# Altium schematic sheet 2_topology.schdoc: OBDH Topology
size A3; Engineer: Eng_2_ALT; SheetNumber: 2; SheetTotal: 6; Designed by: André M. P. Mattos; Version: v0.7; ProjectRevision: v0.7; ProjectCode: obdh2
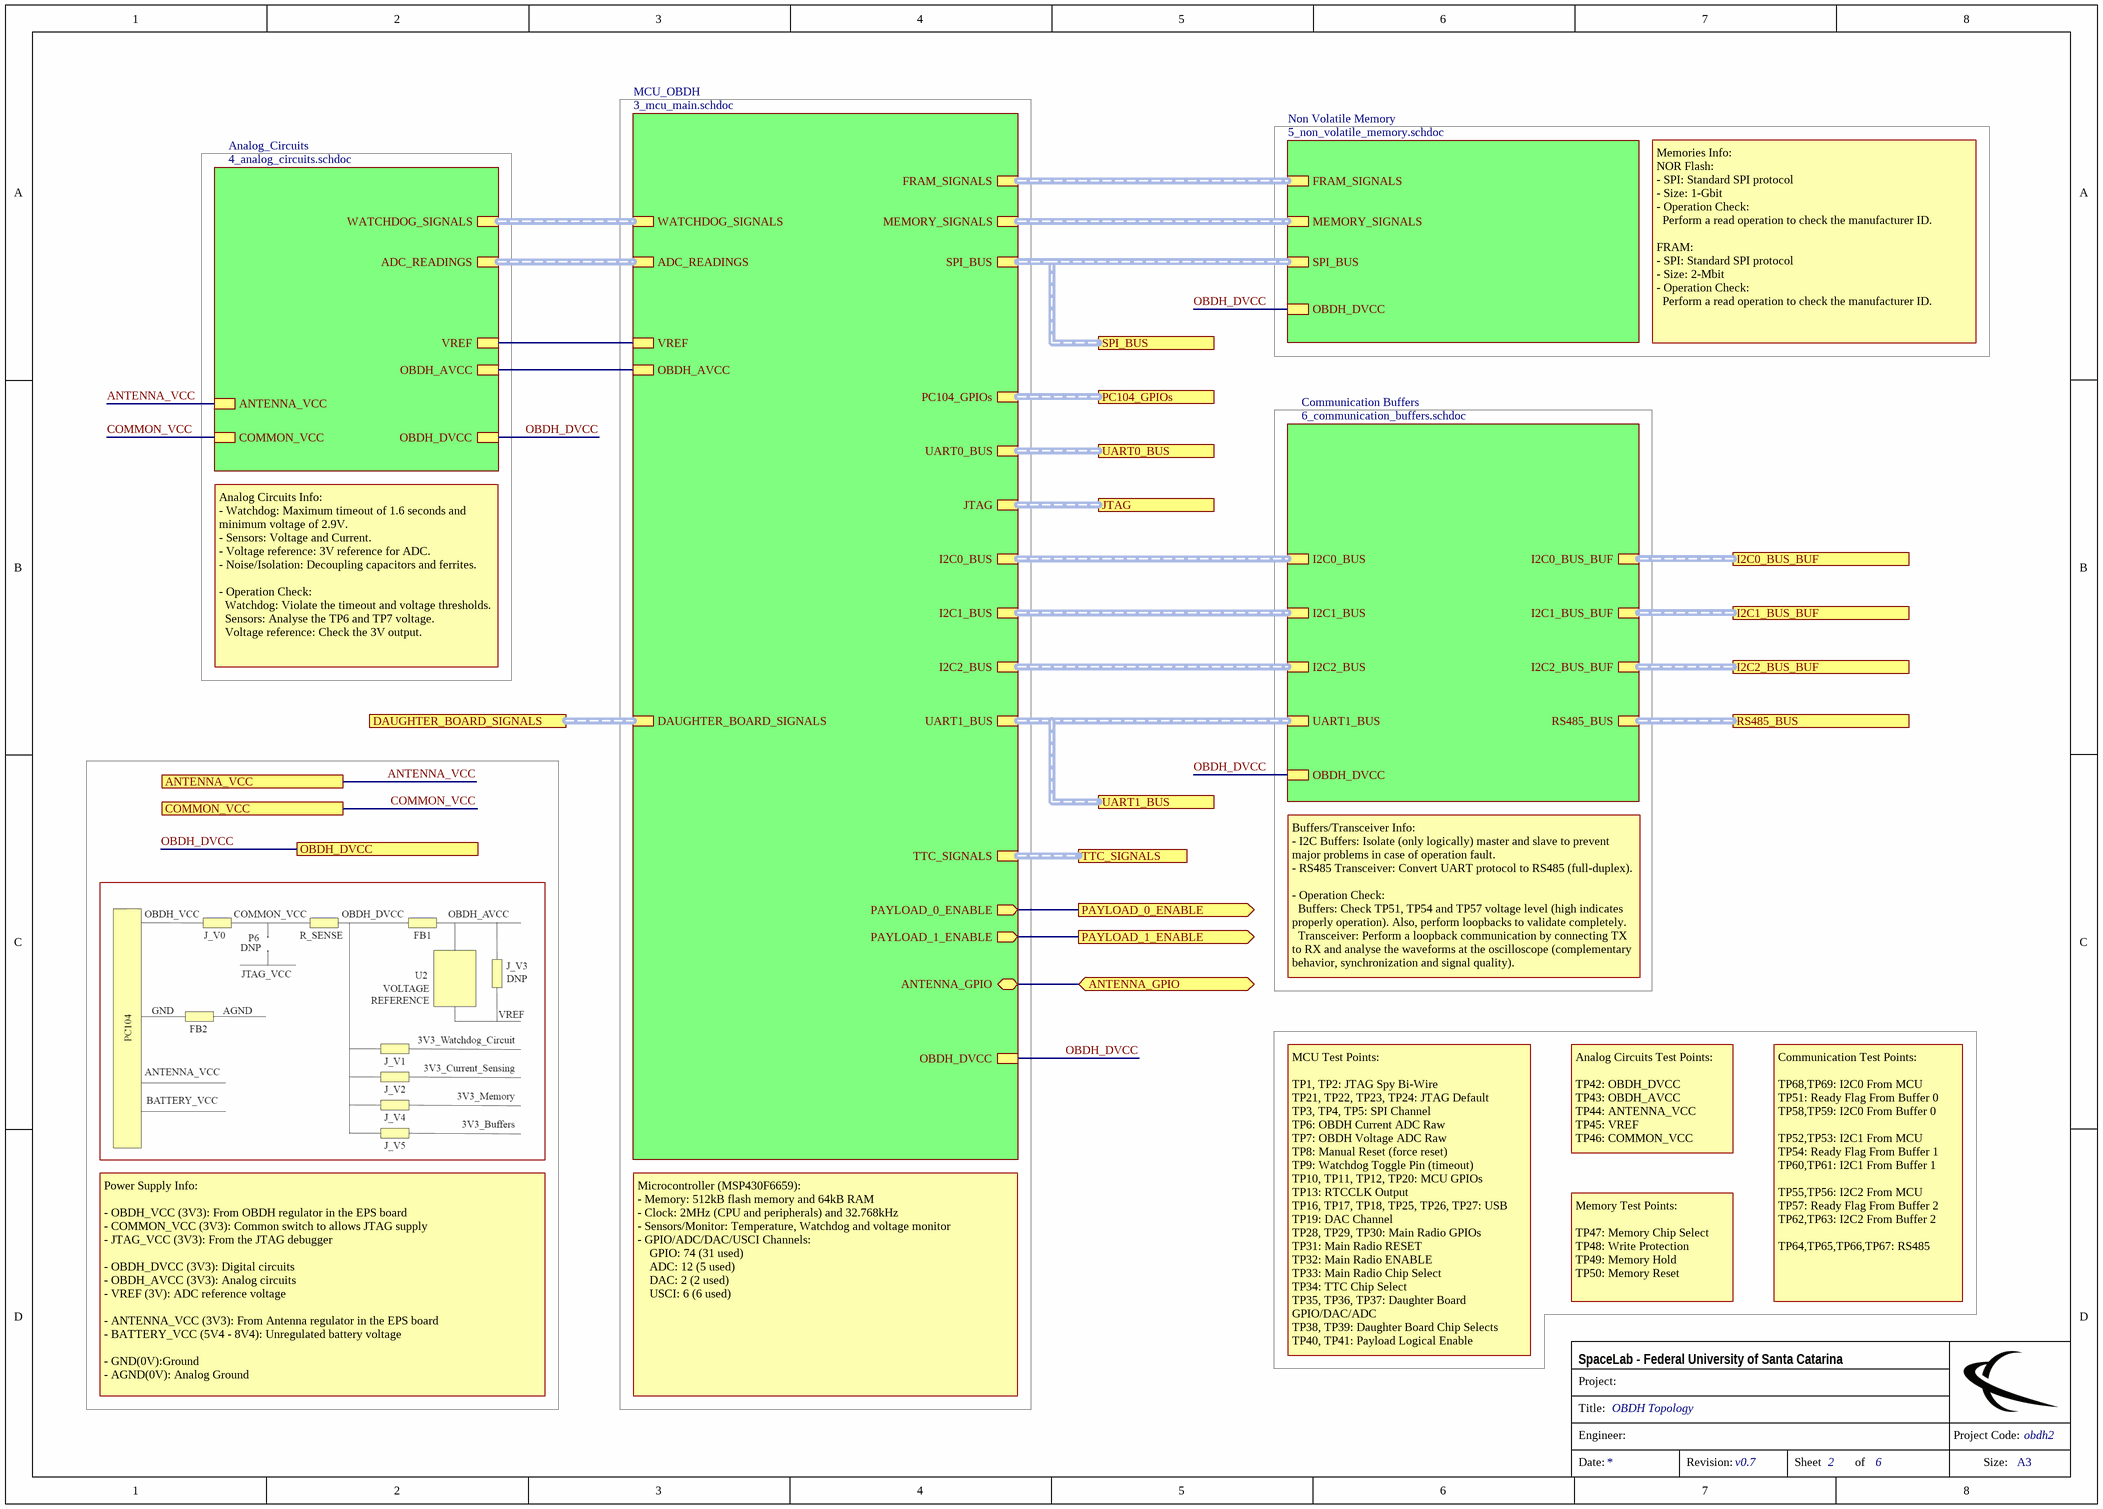
[diagram p0: 2_topology.schdoc]

## Sub-sheets
Analog_Circuits = 4_analog_circuits.schdoc: COMMON_VCC, ADC_READINGS (harness ADC_READINGS), OBDH_DVCC, ANTENNA_VCC, OBDH_AVCC, VREF, WATCHDOG_SIGNALS (harness WATCHDOG_SIGNALS)
Communication Buffers = 6_communication_buffers.schdoc: OBDH_DVCC, I2C0_BUS (harness I2C0_BUS), I2C1_BUS (harness I2C1_BUS), I2C2_BUS (harness I2C2_BUS), UART1_BUS (harness UART1_BUS), RS485_BUS (harness RS485_BUS), I2C0_BUS_BUF (harness I2C0_BUS_BUF), I2C1_BUS_BUF (harness I2C1_BUS_BUF), I2C2_BUS_BUF (harness I2C2_BUS_BUF)
MCU_OBDH = 3_mcu_main.schdoc: JTAG (harness JTAG), UART0_BUS (harness UART0_BUS), PAYLOAD_0_ENABLE (out), ADC_READINGS (harness ADC_READINGS), PAYLOAD_1_ENABLE (out), I2C2_BUS (harness I2C2_BUS), I2C0_BUS (harness I2C0_BUS), ANTENNA_GPIO (bidir), UART1_BUS (harness UART1_BUS), I2C1_BUS (harness I2C1_BUS), SPI_BUS (harness SPI_BUS), TTC_SIGNALS (harness TTC_SIGNALS), OBDH_AVCC, VREF, WATCHDOG_SIGNALS (harness WATCHDOG_SIGNALS), OBDH_DVCC, DAUGHTER_BOARD_SIGNALS (harness DAUGHTER_BOARD_SIGNALS), PC104_GPIOs (harness PC104_GPIOs), MEMORY_SIGNALS (harness MEMORY_SIGNALS), FRAM_SIGNALS (harness FRAM_SIGNALS)
Non Volatile Memory = 5_non_volatile_memory.schdoc: OBDH_DVCC, SPI_BUS (harness SPI_BUS), MEMORY_SIGNALS (harness MEMORY_SIGNALS), FRAM_SIGNALS (harness FRAM_SIGNALS)

## Ports
ANTENNA_GPIO (bidir), ANTENNA_VCC, COMMON_VCC, DAUGHTER_BOARD_SIGNALS (harness DAUGHTER_BOARD_SIGNALS), I2C0_BUS_BUF (harness I2C0_BUS), I2C1_BUS_BUF (harness I2C0_BUS), I2C2_BUS_BUF (harness I2C2_BUS), JTAG (harness TTC_SIGNALS), OBDH_DVCC, PAYLOAD_0_ENABLE (out), PAYLOAD_1_ENABLE (out), PC104_GPIOs (harness TTC_SIGNALS), RS485_BUS (harness I2C2_BUS), SPI_BUS (harness I2C0_BUS), TTC_SIGNALS (harness TTC_SIGNALS), UART0_BUS (harness TTC_SIGNALS), UART1_BUS (harness I2C0_BUS)

## Nets
ANTENNA_GPIO: port ANTENNA_GPIO, sheet MCU_OBDH/ANTENNA_GPIO
ANTENNA_VCC: port ANTENNA_VCC, sheet Analog_Circuits/ANTENNA_VCC
COMMON_VCC: port COMMON_VCC, sheet Analog_Circuits/COMMON_VCC
OBDH_DVCC: port OBDH_DVCC, sheet MCU_OBDH/OBDH_DVCC, sheet Analog_Circuits/OBDH_DVCC, sheet Non Volatile Memory/OBDH_DVCC, sheet Communication Buffers/OBDH_DVCC
PAYLOAD_0_ENABLE: port PAYLOAD_0_ENABLE, sheet MCU_OBDH/PAYLOAD_0_ENABLE
PAYLOAD_1_ENABLE: port PAYLOAD_1_ENABLE, sheet MCU_OBDH/PAYLOAD_1_ENABLE
(unnamed): sheet MCU_OBDH/OBDH_AVCC, sheet Analog_Circuits/OBDH_AVCC
(unnamed): sheet MCU_OBDH/VREF, sheet Analog_Circuits/VREF

## Buses and harness runs
harness port DAUGHTER_BOARD_SIGNALS = sheet MCU_OBDH/DAUGHTER_BOARD_SIGNALS
harness port I2C0_BUS_BUF = sheet Communication Buffers/I2C0_BUS_BUF
harness port I2C1_BUS_BUF = sheet Communication Buffers/I2C1_BUS_BUF
harness port I2C2_BUS_BUF = sheet Communication Buffers/I2C2_BUS_BUF
harness port JTAG = sheet MCU_OBDH/JTAG
harness port PC104_GPIOs = sheet MCU_OBDH/PC104_GPIOs
harness port RS485_BUS = sheet Communication Buffers/RS485_BUS
harness port SPI_BUS = sheet MCU_OBDH/SPI_BUS = sheet Non Volatile Memory/SPI_BUS
harness port TTC_SIGNALS = sheet MCU_OBDH/TTC_SIGNALS
harness port UART0_BUS = sheet MCU_OBDH/UART0_BUS
harness port UART1_BUS = sheet Communication Buffers/UART1_BUS = sheet MCU_OBDH/UART1_BUS
harness sheet Analog_Circuits/ADC_READINGS = sheet MCU_OBDH/ADC_READINGS
harness sheet Analog_Circuits/WATCHDOG_SIGNALS = sheet MCU_OBDH/WATCHDOG_SIGNALS
harness sheet Communication Buffers/I2C0_BUS = sheet MCU_OBDH/I2C0_BUS
harness sheet Communication Buffers/I2C1_BUS = sheet MCU_OBDH/I2C1_BUS
harness sheet Communication Buffers/I2C2_BUS = sheet MCU_OBDH/I2C2_BUS
harness sheet MCU_OBDH/FRAM_SIGNALS = sheet Non Volatile Memory/FRAM_SIGNALS
harness sheet MCU_OBDH/MEMORY_SIGNALS = sheet Non Volatile Memory/MEMORY_SIGNALS

## Notes on the sheet
- Memories Info:
  NOR Flash:
  - SPI: Standard SPI protocol
  - Size: 1-Gbit
  - Operation Check:
  Perform a read operation to check the manufacturer ID.
  FRAM:
  - SPI: Standard SPI protocol
  - Size: 2-Mbit
  - Operation Check:
  Perform a read operation to check the manufacturer ID.
- Analog Circuits Info:
  - Watchdog: Maximum timeout of 1.6 seconds and minimum voltage of 2.9V.
  - Sensors: Voltage and Current.
  - Voltage reference: 3V reference for ADC.
  - Noise/Isolation: Decoupling capacitors and ferrites.
  - Operation Check:
  Watchdog: Violate the timeout and voltage thresholds.
  Sensors: Analyse the TP6 and TP7 voltage.
  Voltage reference: Check the 3V output.
- Buffers/Transceiver Info:
  - I2C Buffers: Isolate (only logically) master and slave to prevent major problems in case of operation fault.
  - RS485 Transceiver: Convert UART protocol to RS485 (full-duplex).
  - Operation Check:
  Buffers: Check TP51, TP54 and TP57 voltage level (high indicates properly operation). Also, perform loopbacks to validate completely.
  Transceiver: Perform a loopback communication by connecting TX to RX and analyse the waveforms at the oscilloscope (complementary behavior, synchronization and signal quality).
- Analog Circuits Test Points:
  TP42: OBDH_DVCC
  TP43: OBDH_AVCC
  TP44: ANTENNA_VCC
  TP45: VREF
  TP46: COMMON_VCC
- Memory Test Points:
  TP47: Memory Chip Select
  TP48: Write Protection
  TP49: Memory Hold
  TP50: Memory Reset
- Communication Test Points:
  TP68,TP69: I2C0 From MCU
  TP51: Ready Flag From Buffer 0
  TP58,TP59: I2C0 From Buffer 0
  TP52,TP53: I2C1 From MCU
  TP54: Ready Flag From Buffer 1
  TP60,TP61: I2C1 From Buffer 1
  TP55,TP56: I2C2 From MCU
  TP57: Ready Flag From Buffer 2
  TP62,TP63: I2C2 From Buffer 2
  TP64,TP65,TP66,TP67: RS485
- Power Supply Info:
  - OBDH_VCC (3V3): From OBDH regulator in the EPS board
  - COMMON_VCC (3V3): Common switch to allows JTAG supply
  - JTAG_VCC (3V3): From the JTAG debugger
  - OBDH_DVCC (3V3): Digital circuits
  - OBDH_AVCC (3V3): Analog circuits
  - VREF (3V): ADC reference voltage
  - ANTENNA_VCC (3V3): From Antenna regulator in the EPS board
  - BATTERY_VCC (5V4 - 8V4): Unregulated battery voltage
  - GND(0V):Ground
  - AGND(0V): Analog Ground
- Microcontroller (MSP430F6659):
  - Memory: 512kB flash memory and 64kB RAM
  - Clock: 2MHz (CPU and peripherals) and 32.768kHz
  - Sensors/Monitor: Temperature, Watchdog and voltage monitor
  - GPIO/ADC/DAC/USCI Channels:
  GPIO: 74 (31 used)
  ADC: 12 (5 used)
  DAC: 2 (2 used)
  USCI: 6 (6 used)
- MCU Test Points:
  TP1, TP2: JTAG Spy Bi-Wire
  TP21, TP22, TP23, TP24: JTAG Default
  TP3, TP4, TP5: SPI Channel
  TP6: OBDH Current ADC Raw
  TP7: OBDH Voltage ADC Raw
  TP8: Manual Reset (force reset)
  TP9: Watchdog Toggle Pin (timeout)
  TP10, TP11, TP12, TP20: MCU GPIOs
  TP13: RTCCLK Output
  TP16, TP17, TP18, TP25, TP26, TP27: USB
  TP19: DAC Channel
  TP28, TP29, TP30: Main Radio GPIOs
  TP31: Main Radio RESET
  TP32: Main Radio ENABLE
  TP33: Main Radio Chip Select
  TP34: TTC Chip Select
  TP35, TP36, TP37: Daughter Board GPIO/DAC/ADC
  TP38, TP39: Daughter Board Chip Selects
  TP40, TP41: Payload Logical Enable
- Project:
- SpaceLab - Federal University of Santa Catarina
- Title:
- Engineer:
- Project Code:
- Date:
- Revision:
- Sheet
- of
- Size:
- A3